# EAGLE design rs-485-multiplier (EAGLE 6.4)
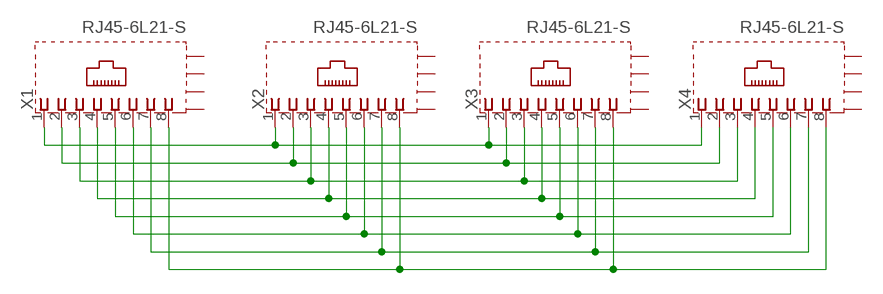
[diagram p0: schematic, sheet 1]

## Parts
X1  RJ45-6L21-S  [RJ45-SHIELD1]
X2  RJ45-6L21-S  [RJ45-SHIELD1]
X3  RJ45-6L21-S  [RJ45-SHIELD1]
X4  RJ45-6L21-S  [RJ45-SHIELD1]

## Nets
N$1: X1.1 X2.1 X3.1 X4.1
N$2: X1.2 X2.2 X3.2 X4.2
N$3: X1.3 X2.3 X3.3 X4.3
N$4: X1.4 X2.4 X3.4 X4.4
N$5: X1.5 X2.5 X3.5 X4.5
N$6: X1.6 X2.6 X3.6 X4.6
N$7: X1.7 X2.7 X3.7 X4.7
N$8: X1.8 X2.8 X3.8 X4.8
Unconnected: X1.S1(S) X1.S2(S) X1.S3(S) X1.S4(S) X2.S1(S) X2.S2(S) X2.S3(S) X2.S4(S) X3.S1(S) X3.S2(S) X3.S3(S) X3.S4(S) X4.S1(S) X4.S2(S) X4.S3(S) X4.S4(S)

## Library data of the parts
X1-X4 = con-tycoelectronics:RJ45*2: RJ45 Low Profile Shield Type 2 For all RJ45 L, LC, LCT and X Series Models Source: www.tycoelectronics.com .. ENG_DS_1654001_1099_RJ_L_0507.pdf; OC_FARNELL: unknown; OC_NEWARK: unknown

## Board
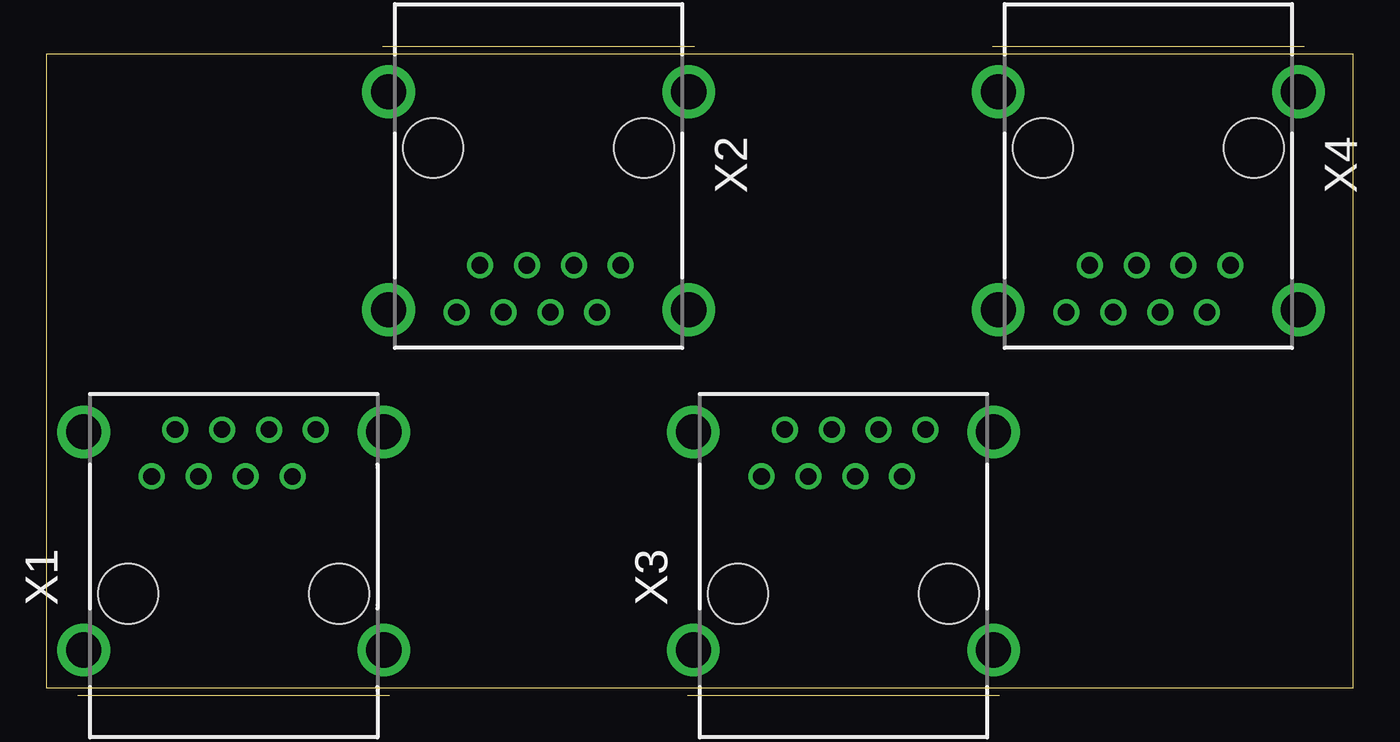
[diagram p1: board, top side]
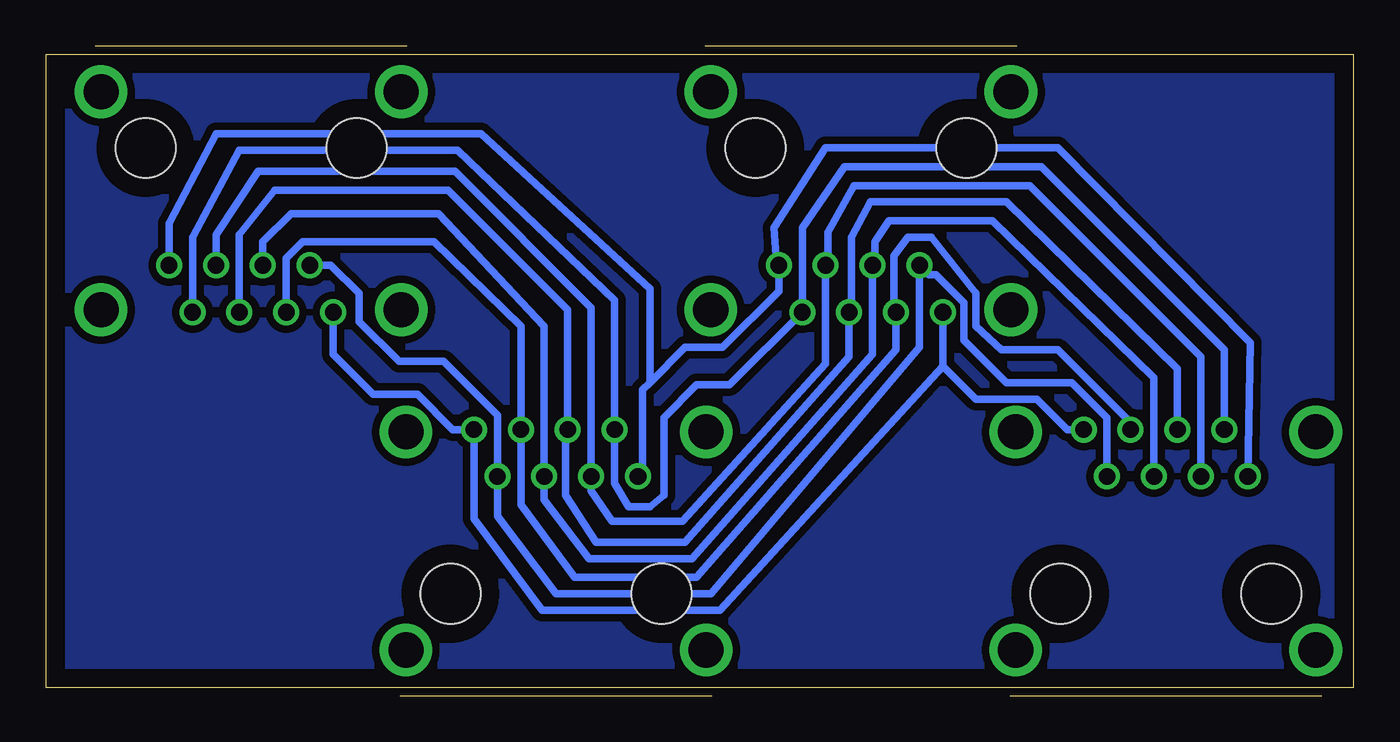
[diagram p2: board, bottom side, seen from below]

Size 70.79 x 34.28 mm. Coordinates in mm from the lower left corner, seen from the top.
Outline: 0,0 70.79,0 70.79,34.28 0,34.28 0,0
Copper layers (1*16): Top 0.035mm / dielectric 1.5mm / Bottom 0.035mm
Design rules "default *": minimum track width 10mil, minimum drill 24mil, track to track 16mil, track to pad 16mil, pad to pad 16mil, via to via 16mil, smd to smd 16mil, copper to edge 40mil, drill to drill 8mil, minimum pad ring 10mil, minimum via ring 8mil, stop-mask expansion 4mil, vias tented up to drill 0mil, thermal gap 10mil

### Footprints (pad centres in the part's own frame; a part is rotated, then mirrored left to right if it is on the bottom)
RJ45-SHIELD1 = drill 0.9 pad 1.4: 1 -4.445,6.35; 2 -3.175,8.89; 3 -1.905,6.35; 4 -0.635,8.89; 5 0.635,6.35; 6 1.905,8.89; 7 3.175,6.35; 8 4.445,8.89 | drill 1.9 pad 2.5: S1 -8.128,-3.048; S2 8.128,-3.048; S3 -8.128,8.76; S4 8.128,8.76 | hole 3.251: -5.715,0; 5.715,0

### Placement (x,y rotation side)
X1  10.16,5.08 0 top
X2  26.67,29.21 180 top
X3  43.18,5.08 0 top
X4  59.69,29.21 180 top

### Tracks (layer width: path | path; a pad name or v marks a point on that pad's centre or on a via)
N$1
  Bottom 0.406: 38.1,16.51 36.2,18.41 34.16,18.41 31.11,21.46 X2.1 31.24,22.99 31.37,24.89 28.57,29.21 16,29.21 5.59,18.67 X1.1 | 38.1,16.51 38.48,16.13 38.48,11.68 X3.1 | X4.1 64.14,25.15 61.59,29.97 47.24,29.97 38.1,21.59 38.1,16.51
N$2
  Bottom 0.406: X4.2 62.87,24.38 60.33,29.08 48.51,29.08 40.01,20.95 X3.2 40.01,11.05 39.24,9.78 38.1,9.78 37.34,10.41 37.34,14.61 35.56,16.38 33.78,16.38 X2.2 29.84,24.89 27.56,28.19 16.89,28.19 6.99,18.29 X1.2
N$3
  Bottom 0.406: X1.3 8.26,17.91 17.53,27.18 27.05,27.18 28.45,24.64 28.45,22.99 X2.3 28.57,17.53 36.32,9.02 40.13,9.02 41.27,10.67 X3.3 41.27,20.57 48.64,27.94 59.31,27.94 61.59,24.51 X4.3
N$4
  Bottom 0.406: X1.4 9.53,17.27 18.8,26.29 26.16,26.29 27.18,24.38 27.18,20.45 X2.4 27.3,17.91 36.2,7.87 41.02,7.87 42.67,10.41 42.67,13.84 X3.4 42.55,20.45 49.02,26.92 58.42,26.92 60.33,24.51 X4.4
N$5
  Bottom 0.406: X1.5 10.79,16.76 19.56,25.27 25.15,25.27 25.91,24.13 25.91,22.99 X2.5 26.04,18.03 35.81,6.99 41.4,6.99 43.81,10.16 X3.5 43.81,19.56 49.53,25.65 57.53,25.65 59.05,24.13 X4.5
N$6
  Bottom 0.406: X1.6 12.06,14.35 16,18.29 19.05,18.29 20.45,19.56 20.45,21.34 22.86,24.38 24.13,24.38 24.89,23.37 24.89,20.45 X2.6 24.77,18.29 35.56,5.97 42.16,5.97 45.09,9.91 X3.6 45.09,19.56 49.78,24.13 56.9,24.13 57.78,23.24 X4.6
N$7
  Bottom 0.406: X1.7 13.34,14.61 15.24,16.51 18.8,16.51 21.08,18.8 21.08,20.83 22.61,22.35 22.99,22.35 X2.7 23.5,18.41 34.8,5.08 43.18,5.08 46.35,9.27 X3.7 46.35,14.73 49.28,17.65 51.69,17.65 53.85,19.81 53.85,21.34 55.37,22.86 X4.7
N$8
  Bottom 0.406: 22.23,17.4 34.29,4.19 43.94,4.19 47.62,9.14 X3.8 48.77,13.97 50.67,15.88 53.09,15.88 55.24,18.03 X4.8 | 22.23,17.4 X2.8 | X1.8 15.49,13.97 17.14,15.62 20.45,15.62 22.23,17.4
N$9
  pour Bottom: 0,34.29 0,0 71.12,0 71.12,34.29